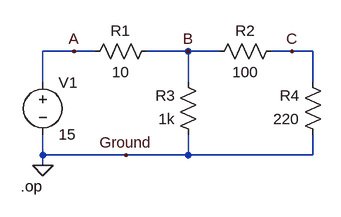
[diagram p0: schematic E1-DC-op-pnt.asc]
E1-DC-op-pnt.asc, the LTspice schematic file:
Version 4
SHEET 1 880 680
WIRE -528 -352 -576 -352
WIRE -496 -352 -528 -352
WIRE -352 -352 -416 -352
WIRE -304 -352 -352 -352
WIRE -192 -352 -224 -352
WIRE -160 -352 -192 -352
WIRE -576 -304 -576 -352
WIRE -352 -304 -352 -352
WIRE -160 -304 -160 -352
WIRE -576 -192 -576 -224
WIRE -448 -192 -576 -192
WIRE -352 -192 -352 -224
WIRE -352 -192 -448 -192
WIRE -160 -192 -160 -224
WIRE -160 -192 -352 -192
WIRE -576 -176 -576 -192
FLAG -576 -176 0
FLAG -528 -352 A
FLAG -352 -352 B
FLAG -192 -352 C
FLAG -448 -192 Ground
SYMBOL voltage -576 -320 R0
SYMATTR InstName V1
SYMATTR Value 15
SYMBOL res -400 -368 R90
WINDOW 0 0 56 VBottom 2
WINDOW 3 32 56 VTop 2
SYMATTR InstName R1
SYMATTR Value 10
SYMBOL res -208 -368 R90
WINDOW 0 0 56 VBottom 2
WINDOW 3 32 56 VTop 2
SYMATTR InstName R2
SYMATTR Value 100
SYMBOL res -336 -208 R180
WINDOW 0 36 76 Left 2
WINDOW 3 36 40 Left 2
SYMATTR InstName R3
SYMATTR Value 1k
SYMBOL res -144 -208 R180
WINDOW 0 36 76 Left 2
WINDOW 3 36 40 Left 2
SYMATTR InstName R4
SYMATTR Value 220
TEXT -610 -144 Left 2 !.op

The netlist it stands for:
* E1-DC-op-pnt.asc
V1 A 0 15
R1 B A 10
R2 C B 100
R3 0 B 1k
R4 0 C 220
.op
.backanno
.end

* Results of the author's LTspice run, read from the files saved beside the schematic
* Operating Point:
*   V(a) = 15 V
*   V(b) = 14.41 V
*   V(c) = 9.904 V
*   I(R4) = -45.02 mA
*   I(R3) = -14.41 mA
*   I(R2) = -45.02 mA
*   I(R1) = -59.42 mA
*   I(V1) = -59.42 mA